# EAGLE schematic en_v5 (EAGLE 9.6.2)

## Sheet 1 of 6: Header and connector
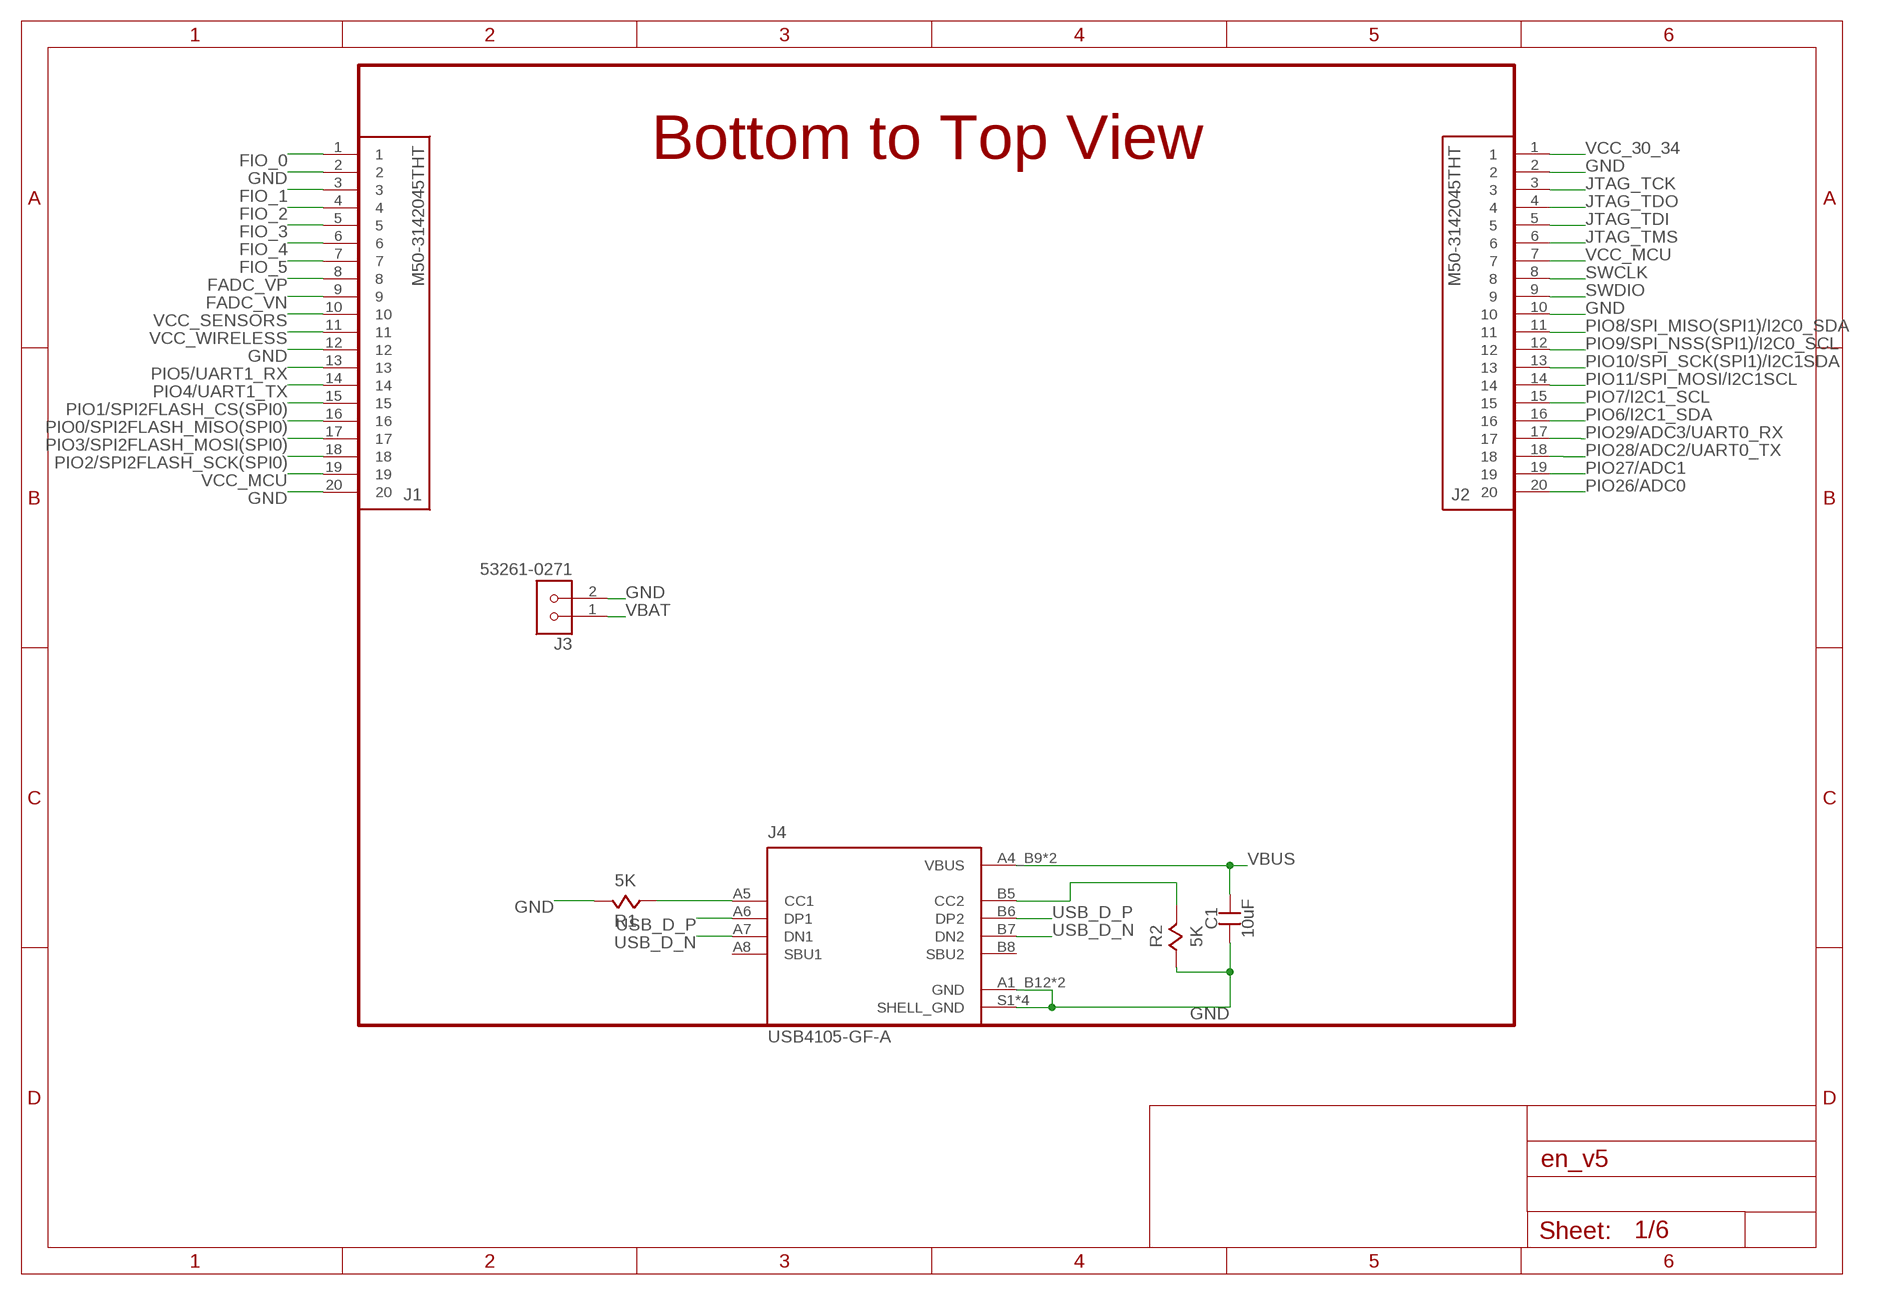
[diagram p0: schematic, sheet 1]

### Parts
C1  10uF  CAPACITOR0805  [0805]
J1  M50-3142045THT  [20X1_HEADER_THT_1.27MM]
J2  M50-3142045THT  [20X1_HEADER_THT_1.27MM]
J3  53261-0271  [MOLEX_53261-0271]
J4  USB4105-GF-A  [GCT_USB4105-GF-A]
R1  5K  RESISTORSMD_0402  [0402]
R2  5K  RESISTORSMD_0402  [0402]

### Nets
FADC_VN: J1.9 ; also sheet 5
FADC_VP: J1.8 ; also sheet 5
FIO_0: J1.1 ; also sheet 5
FIO_1: J1.3 ; also sheet 5
FIO_2: J1.4 ; also sheet 5
FIO_3: J1.5 ; also sheet 5
FIO_4: J1.6 ; also sheet 5
FIO_5: J1.7 ; also sheet 5
GND: C1.1 J1.2 J1.12 J1.20 J2.2 J2.10 J3.2 J4.A1_B12(GND) J4.B1_A12(GND) J4.S1(SHELL_GND) J4.S2(SHELL_GND) J4.S3(SHELL_GND) J4.S4(SHELL_GND) R1.2 R2.1 ; also sheet 2,3,4,5,6
JTAG_TCK: J2.3 ; also sheet 5
JTAG_TDI: J2.5 ; also sheet 5
JTAG_TDO: J2.4 ; also sheet 5
JTAG_TMS: J2.6 ; also sheet 5
N$19: J4.B5(CC2) R2.2
N$35: J4.A5(CC1) R1.1
PIO0/SPI2FLASH_MISO(SPI0): J1.16 ; also sheet 4,6
PIO1/SPI2FLASH_CS(SPI0): J1.15 ; also sheet 4,5,6
PIO2/SPI2FLASH_SCK(SPI0): J1.18 ; also sheet 4,5,6
PIO3/SPI2FLASH_MOSI(SPI0): J1.17 ; also sheet 4,6
PIO4/UART1_TX: J1.14 ; also sheet 4
PIO5/UART1_RX: J1.13 ; also sheet 4
PIO6/I2C1_SDA: J2.16 ; also sheet 3,4
PIO7/I2C1_SCL: J2.15 ; also sheet 3,4
PIO8/SPI_MISO(SPI1)/I2C0_SDA: J2.11 ; also sheet 4
PIO9/SPI_NSS(SPI1)/I2C0_SCL: J2.12 ; also sheet 4
PIO10/SPI_SCK(SPI1)/I2C1SDA: J2.13 ; also sheet 4
PIO11/SPI_MOSI/I2C1SCL: J2.14 ; also sheet 4
PIO26/ADC0: J2.20 ; also sheet 4
PIO27/ADC1: J2.19 ; also sheet 4
PIO28/ADC2/UART0_TX: J2.18 ; also sheet 3,4
PIO29/ADC3/UART0_RX: J2.17 ; also sheet 3,4
SWCLK: J2.8 ; also sheet 4
SWDIO: J2.9 ; also sheet 4
USB_D_N [diff pairs]: J4.A7(DN1) J4.B7(DN2) ; also sheet 4
USB_D_P [diff pairs]: J4.A6(DP1) J4.B6(DP2) ; also sheet 4
VBAT: J3.1 ; also sheet 2
VBUS: C1.2 J4.A4_B9(VBUS) J4.B4_A9(VBUS) ; also sheet 2
VCC_30_34: J2.1 ; also sheet 3,5,6
VCC_MCU: J1.19 J2.7 ; also sheet 3,4
VCC_SENSORS: J1.10 ; also sheet 3,6
VCC_WIRELESS: J1.11 ; also sheet 3
Unconnected: J4.A8(SBU1) J4.B8(SBU2)

### Notes on the sheet
- Bottom to Top View

## Sheet 2 of 6: Power Management
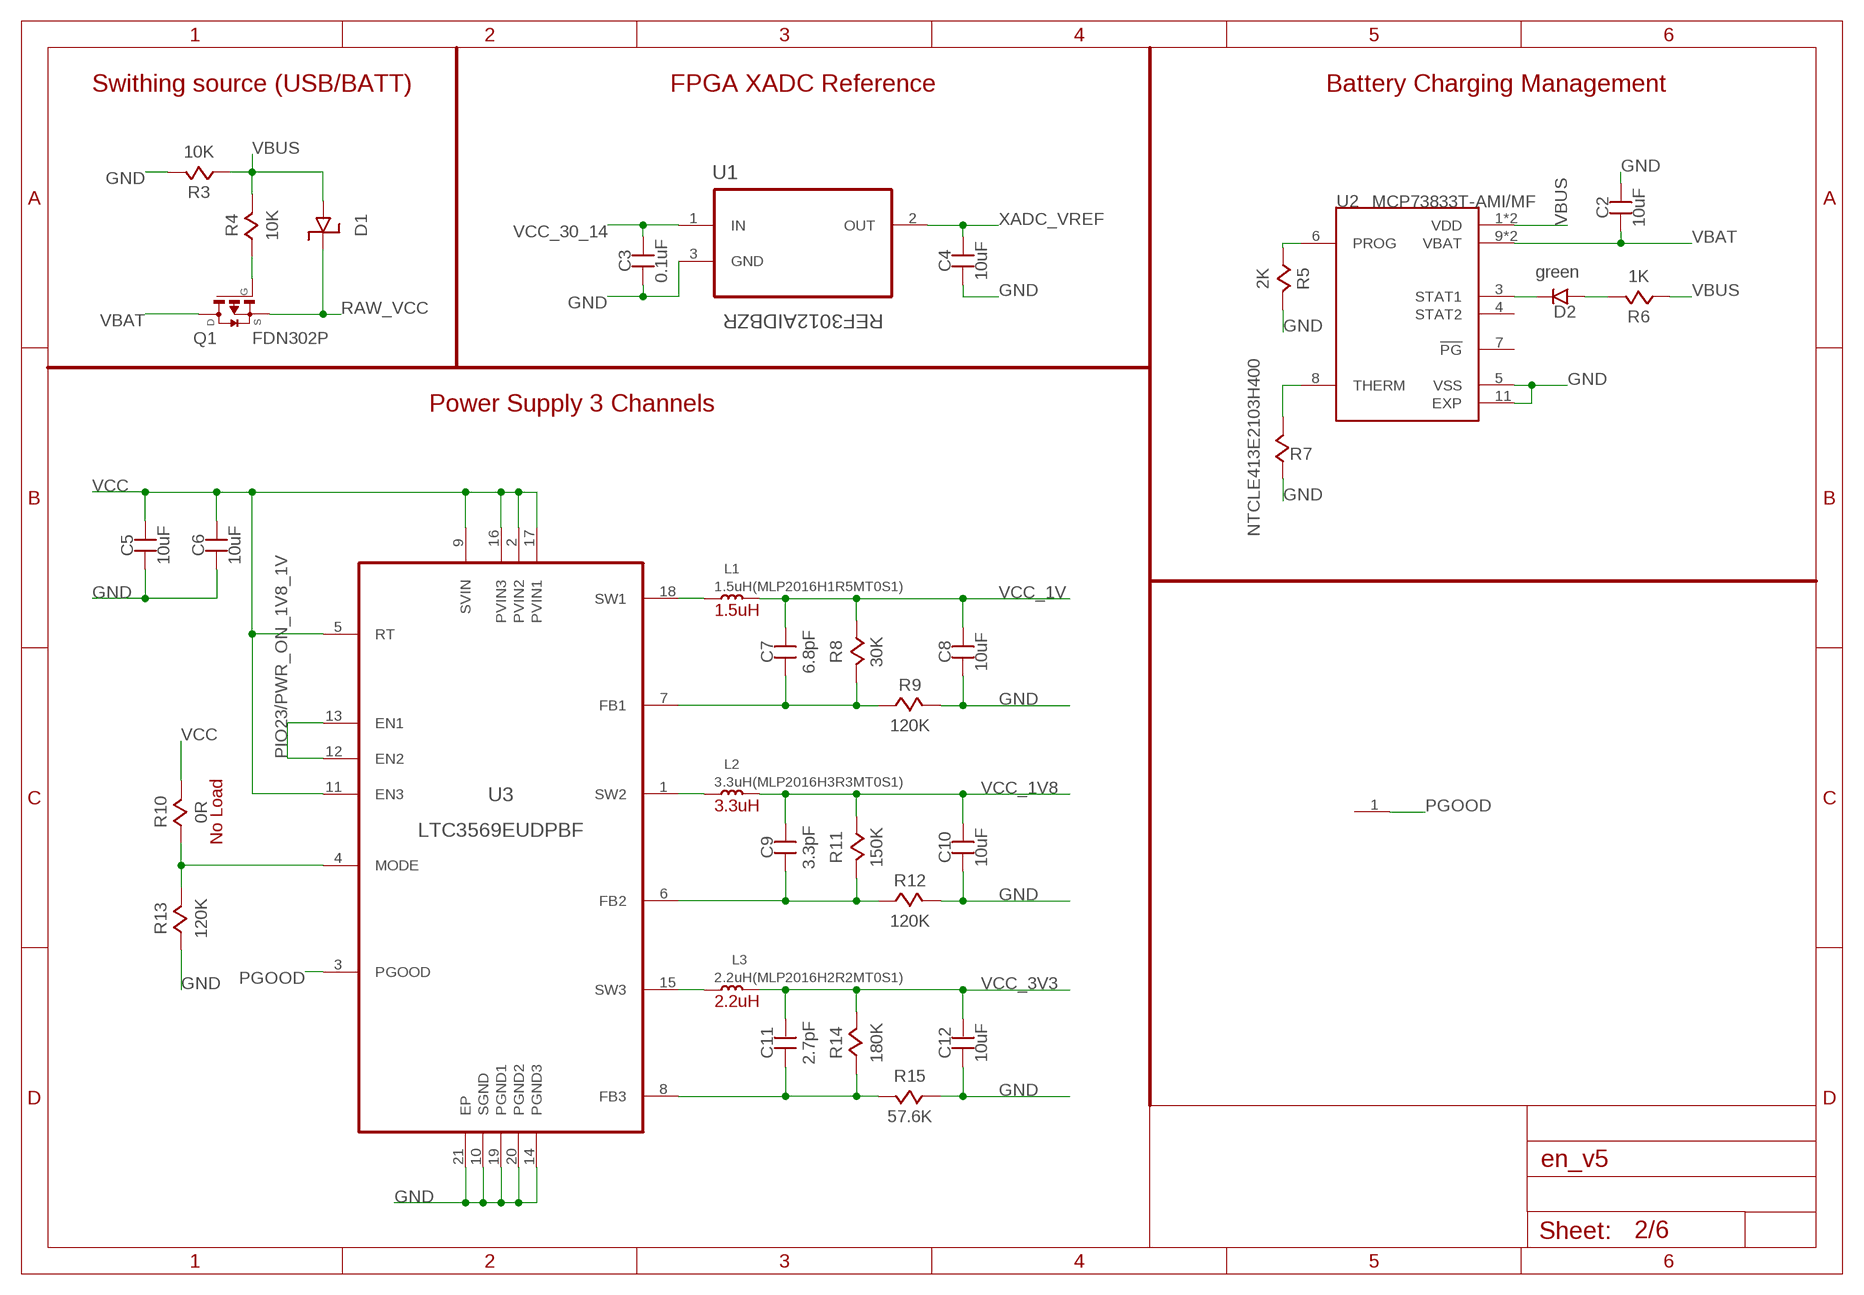
[diagram p1: schematic, sheet 2]

### Parts
C2  10uF  CAPACITOR0805  [0805]
C3  0.1uF  CAPACITOR0402  [0402]
C4  10uF  CAPACITOR0603  [CAPC1608-0603]
C5  10uF  CAPACITOR0603  [CAPC1608-0603]
C6  10uF  CAPACITOR0603  [CAPC1608-0603]
C7  6.8pF  CAPACITOR0402  [0402]
C8  10uF  CAPACITOR0603  [CAPC1608-0603]
C9  3.3pF  CAPACITOR0402  [0402]
C10  10uF  CAPACITOR0603  [CAPC1608-0603]
C11  2.7pF  CAPACITOR0402  [0402]
C12  10uF  CAPACITOR0603  [CAPC1608-0603]
D1  DIODEB5817W  SCHOTTKY_DIODEB5817W  [SOD-123]
D2  green  LED0402  [0402]
L1  1.5uH(MLP2016H1R5MT0S1)  INDUCTORDFE201612E-R33M=P2  [INDC2016X120N]
L2  3.3uH(MLP2016H3R3MT0S1)  INDUCTORDFE201612E-R33M=P2  [INDC2016X120N]
L3  2.2uH(MLP2016H2R2MT0S1)  INDUCTORDFE201612E-R33M=P2  [INDC2016X120N]
Q1  FDN302P  [SSOT-3]
R3  10K  RESISTORSMD_0402  [0402]
R4  10K  RESISTORSMD_0402  [0402]
R5  2K  RESISTORSMD_0402  [0402]
R6  1K  RESISTORSMD_0402  [0402]
R7  NTCLE413E2103H400  RESISTORTHT_THERMAL  [THT_2]
R8  30K  RESISTORSMD_0402  [0402]
R9  120K  RESISTORSMD_0402  [0402]
R10  0R  RESISTORSMD_0402  [0402]
R11  150K  RESISTORSMD_0402  [0402]
R12  120K  RESISTORSMD_0402  [0402]
R13  120K  RESISTORSMD_0402  [0402]
R14  180K  RESISTORSMD_0402  [0402]
R15  57.6K  RESISTORSMD_0402  [0402]
TP2  TEST_POINTSMD  [SMD_PAD]
U1  REF3012AIDBZR  [SOT-23(3PIN)]
U2  MCP73833T-AMI/MF  [DFN-10(3X3X0.9)]
U3  LTC3569EUDPBF  [QFN40P300X300X80-21N]

### Nets
GND: C2.2 C3.1 C4.1 C5.2 C6.2 C8.1 C10.2 C12.2 R3.2 R5.2 R7.P$1 R9.2 R12.2 R13.1 R15.2 U1.3(GND) U2.5(VSS) U2.11(EXP) U3.10(SGND) U3.14(PGND3) U3.19(PGND1) U3.20(PGND2) U3.21(EP) ; also sheet 1,3,4,5,6
N$1: R7.P$2 U2.8(THERM)
N$2: R5.1 U2.6(PROG)
N$3: Q1.1(G) R4.1
N$4: L2.1 U3.1(SW2)
N$5: L1.1 U3.18(SW1)
N$6: D2.2 U2.3(STAT1)
N$7: D2.1 R6.2
N$8: C7.2 R8.2 R9.1 U3.7(FB1)
N$9: L3.2 U3.15(SW3)
N$11: C11.2 R14.2 R15.1 U3.8(FB3)
N$12: C9.2 R11.2 R12.1 U3.6(FB2)
N$23: R10.1 R13.2 U3.4(MODE)
PGOOD: TP2.1(>NAME) U3.3(PGOOD)
PIO23/PWR_ON_1V8_1V: U3.12(EN2) U3.13(EN1) ; also sheet 4
RAW_VCC: D1.1(C) Q1.2(S) ; also sheet 3
VBAT: C2.1 Q1.3(D) U2.9(VBAT) U2.10(VBAT) ; also sheet 1
VBUS: D1.2(A) R3.1 R4.2 R6.1 U2.1(VDD) U2.2(VDD) ; also sheet 1
VCC: C5.1 C6.1 R10.2 U3.2(PVIN2) U3.5(RT) U3.9(SVIN) U3.11(EN3) U3.16(PVIN3) U3.17(PVIN1) ; also sheet 3
VCC_1V: C7.1 C8.2 L1.2 R8.1 ; also sheet 3
VCC_1V8: C9.1 C10.1 L2.2 R11.1 ; also sheet 3
VCC_3V3: C11.1 C12.1 L3.1 R14.1 ; also sheet 3
VCC_30_14: C3.2 U1.1(IN) ; also sheet 3,5,6
XADC_VREF: C4.2 U1.2(OUT) ; also sheet 5
Unconnected: U2.4(STAT2) U2.7(!PG)

### Notes on the sheet
- Swithing source (USB/BATT) | FPGA XADC Reference | Battery Charging Management
- Power Supply 3 Channels
- 1.5uH
- No Load | 3.3uH
- 2.2uH

## Sheet 3 of 6: Power Monitor
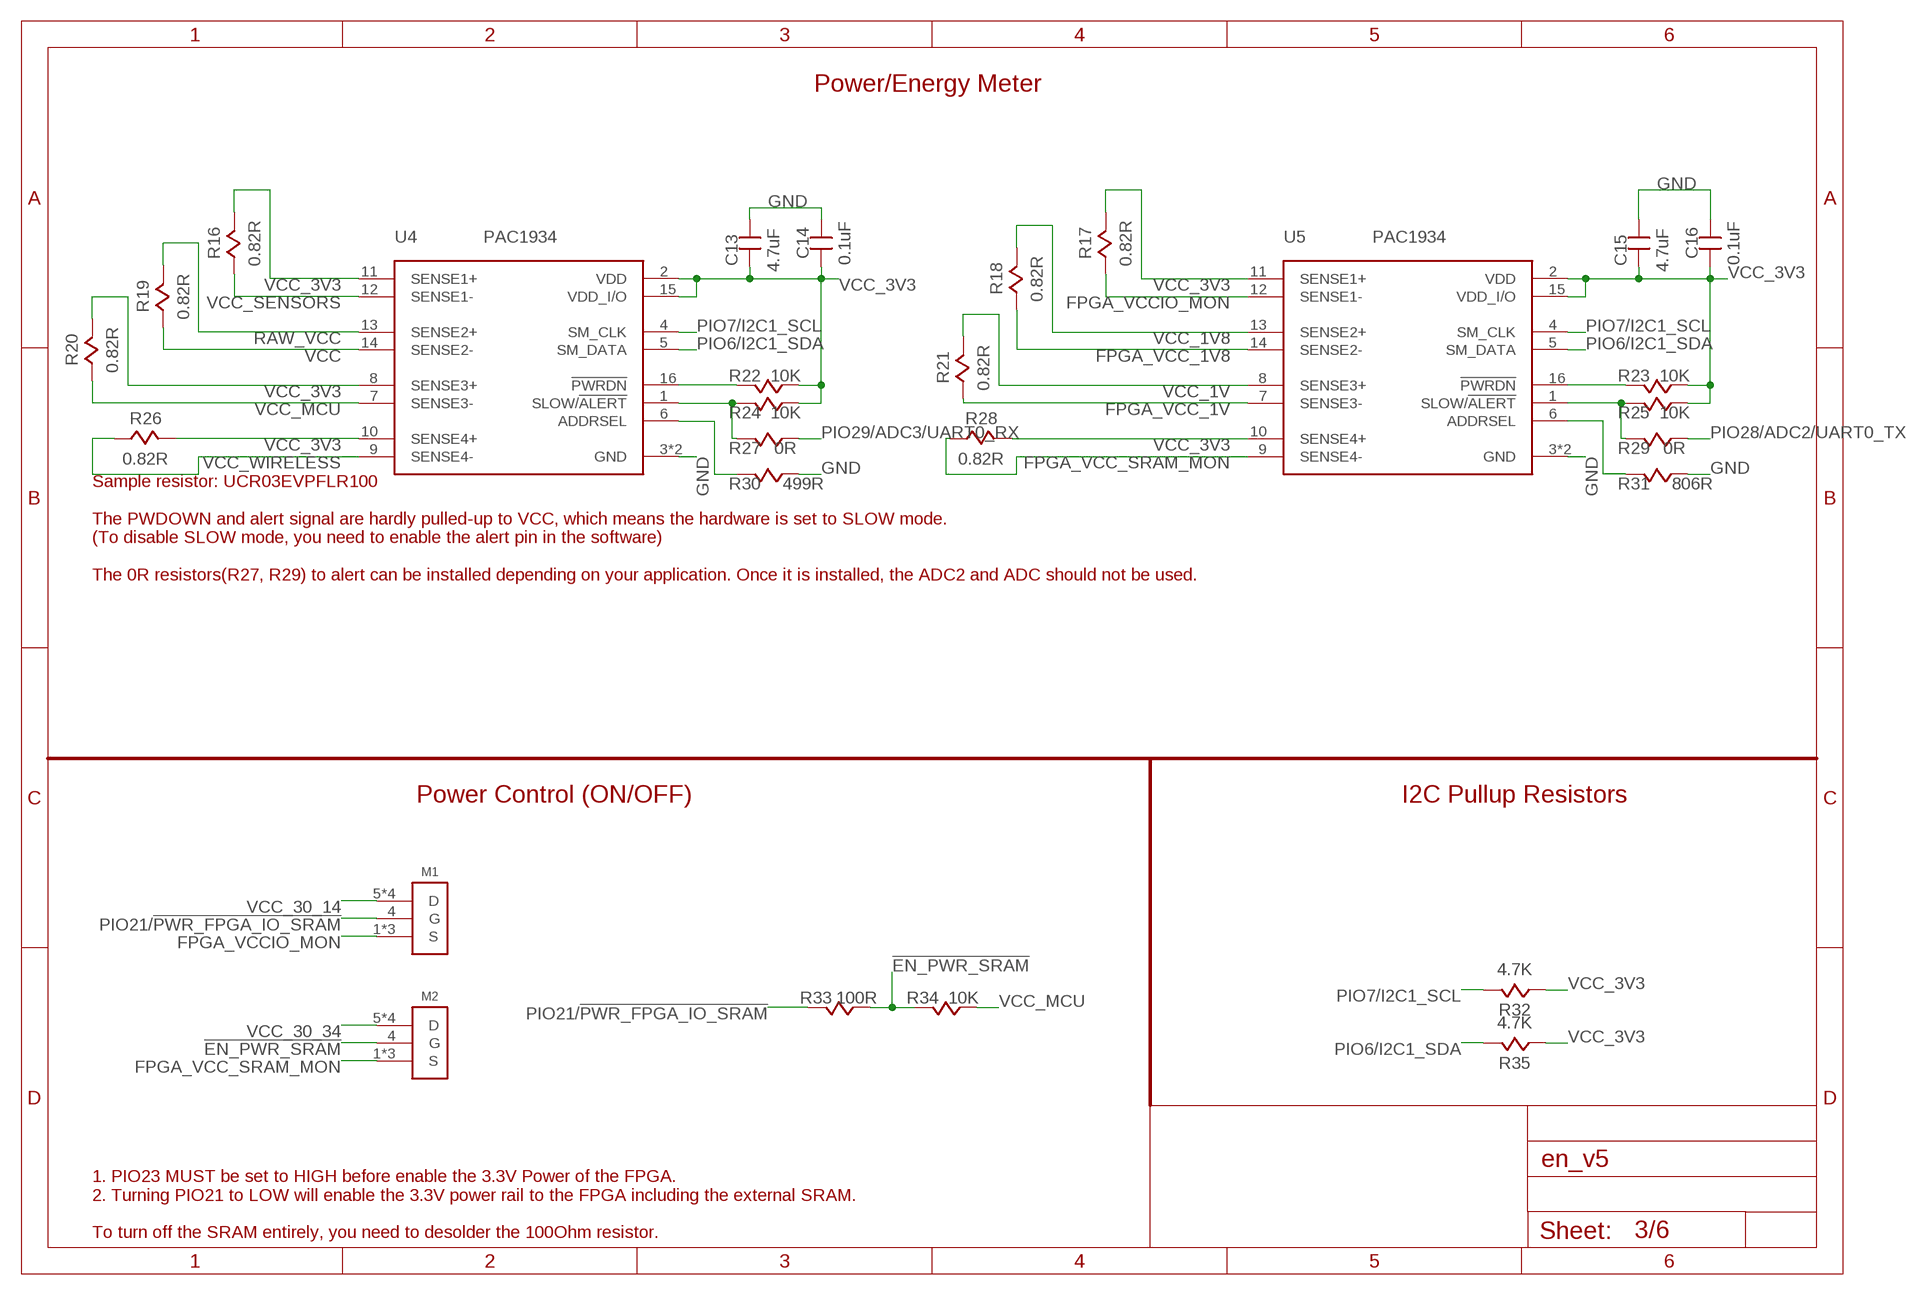
[diagram p2: schematic, sheet 3]

### Parts
C13  4.7uF  CAPACITOR0603  [CAPC1608-0603]
C14  0.1uF  CAPACITOR0402  [0402]
C15  4.7uF  CAPACITOR0603  [CAPC1608-0603]
C16  0.1uF  CAPACITOR0402  [0402]
M1  SISS23DN  [POWERPAK1212-8]
M2  SISS23DN  [POWERPAK1212-8]
R16  0.82R  RESISTOR0603  [0603]
R17  0.82R  RESISTOR0603  [0603]
R18  0.82R  RESISTOR0603  [0603]
R19  0.82R  RESISTOR0603  [0603]
R20  0.82R  RESISTOR0603  [0603]
R21  0.82R  RESISTOR0603  [0603]
R22  10K  RESISTORSMD_0402  [0402]
R23  10K  RESISTORSMD_0402  [0402]
R24  10K  RESISTORSMD_0402  [0402]
R25  10K  RESISTORSMD_0402  [0402]
R26  0.82R  RESISTOR0603  [0603]
R27  0R  RESISTORSMD_0402  [0402]
R28  0.82R  RESISTOR0603  [0603]
R29  0R  RESISTORSMD_0402  [0402]
R30  499R  RESISTORSMD_0402  [0402]
R31  806R  RESISTORSMD_0402  [0402]
R32  4.7K  RESISTORSMD_0402  [0402]
R33  100R  RESISTORSMD_0402  [0402]
R34  10K  RESISTORSMD_0402  [0402]
R35  4.7K  RESISTORSMD_0402  [0402]
U4  PAC1934  [UQFN-16(4×4×0.5MM)]
U5  PAC1934  [UQFN-16(4×4×0.5MM)]

### Nets
!EN_PWR_SRAM: M2.4(G) R33.1 R34.2
FPGA_VCC_1V: R21.1 U5.7(SENSE3-) ; also sheet 5,6
FPGA_VCC_1V8: R18.1 U5.14(SENSE2-) ; also sheet 5,6
FPGA_VCC_SRAM_MON: M2.1(S) M2.2(S) M2.3(S) R28.1 U5.9(SENSE4-)
FPGA_VCCIO_MON: M1.1(S) M1.2(S) M1.3(S) R17.1 U5.12(SENSE1-)
GND: C13.2 C14.2 C15.2 C16.2 R30.1 R31.1 U4.3(GND) U4.17(GND) U5.3(GND) U5.17(GND) ; also sheet 1,2,4,5,6
N$13: R24.2 R27.2 U4.1(SLOW/!ALERT)
N$21: R25.2 R29.2 U5.1(SLOW/!ALERT)
N$32: R22.2 U4.16(!PWRDN)
N$34: R30.2 U4.6(ADDRSEL)
N$48: R23.2 U5.16(!PWRDN)
N$50: R31.2 U5.6(ADDRSEL)
PIO6/I2C1_SDA: R35.2 U4.5(SM_DATA) U5.5(SM_DATA) ; also sheet 1,4
PIO7/I2C1_SCL: R32.2 U4.4(SM_CLK) U5.4(SM_CLK) ; also sheet 1,4
PIO21/!PWR_FPGA_IO_SRAM: M1.4(G) R33.2 ; also sheet 4
PIO28/ADC2/UART0_TX: R29.1 ; also sheet 1,4
PIO29/ADC3/UART0_RX: R27.1 ; also sheet 1,4
RAW_VCC: R19.2 U4.13(SENSE2+) ; also sheet 2
VCC: R19.1 U4.14(SENSE2-) ; also sheet 2
VCC_1V: R21.2 U5.8(SENSE3+) ; also sheet 2
VCC_1V8: R18.2 U5.13(SENSE2+) ; also sheet 2
VCC_3V3: C13.1 C14.1 C15.1 C16.1 R16.2 R17.2 R20.2 R22.1 R23.1 R24.1 R25.1 R26.2 R28.2 R32.1 R35.1 U4.2(VDD) U4.8(SENSE3+) U4.10(SENSE4+) U4.11(SENSE1+) U4.15(VDD_I/O) U5.2(VDD) U5.10(SENSE4+) U5.11(SENSE1+) U5.15(VDD_I/O) ; also sheet 2
VCC_30_14: M1.5(D) M1.6(D) M1.7(D) M1.8(D) ; also sheet 2,5,6
VCC_30_34: M2.5(D) M2.6(D) M2.7(D) M2.8(D) ; also sheet 1,5,6
VCC_MCU: R20.1 R34.1 U4.7(SENSE3-) ; also sheet 1,4
VCC_SENSORS: R16.1 U4.12(SENSE1-) ; also sheet 1,6
VCC_WIRELESS: R26.1 U4.9(SENSE4-) ; also sheet 1

### Notes on the sheet
- Power/Energy Meter
- Sample resistor: UCR03EVPFLR100
  
  The PWDOWN and alert signal are hardly pulled-up to VCC, which means the hardware is set to SLOW mode.
  (To disable SLOW mode, you need to enable the alert pin in the software)
  
  The 0R resistors(R27, R29) to alert can be installed depending on your application. Once it is installed, the ADC2 and ADC should not be used.
- Power Control (ON/OFF) | I2C Pullup Resistors
- 1. PIO23 MUST be set to HIGH before enable the 3.3V Power of the FPGA.
  2. Turning PIO21 to LOW will enable the 3.3V power rail to the FPGA including the external SRAM.
  
  To turn off the SRAM entirely, you need to desolder the 100Ohm resistor.

## Sheet 4 of 6: MCU
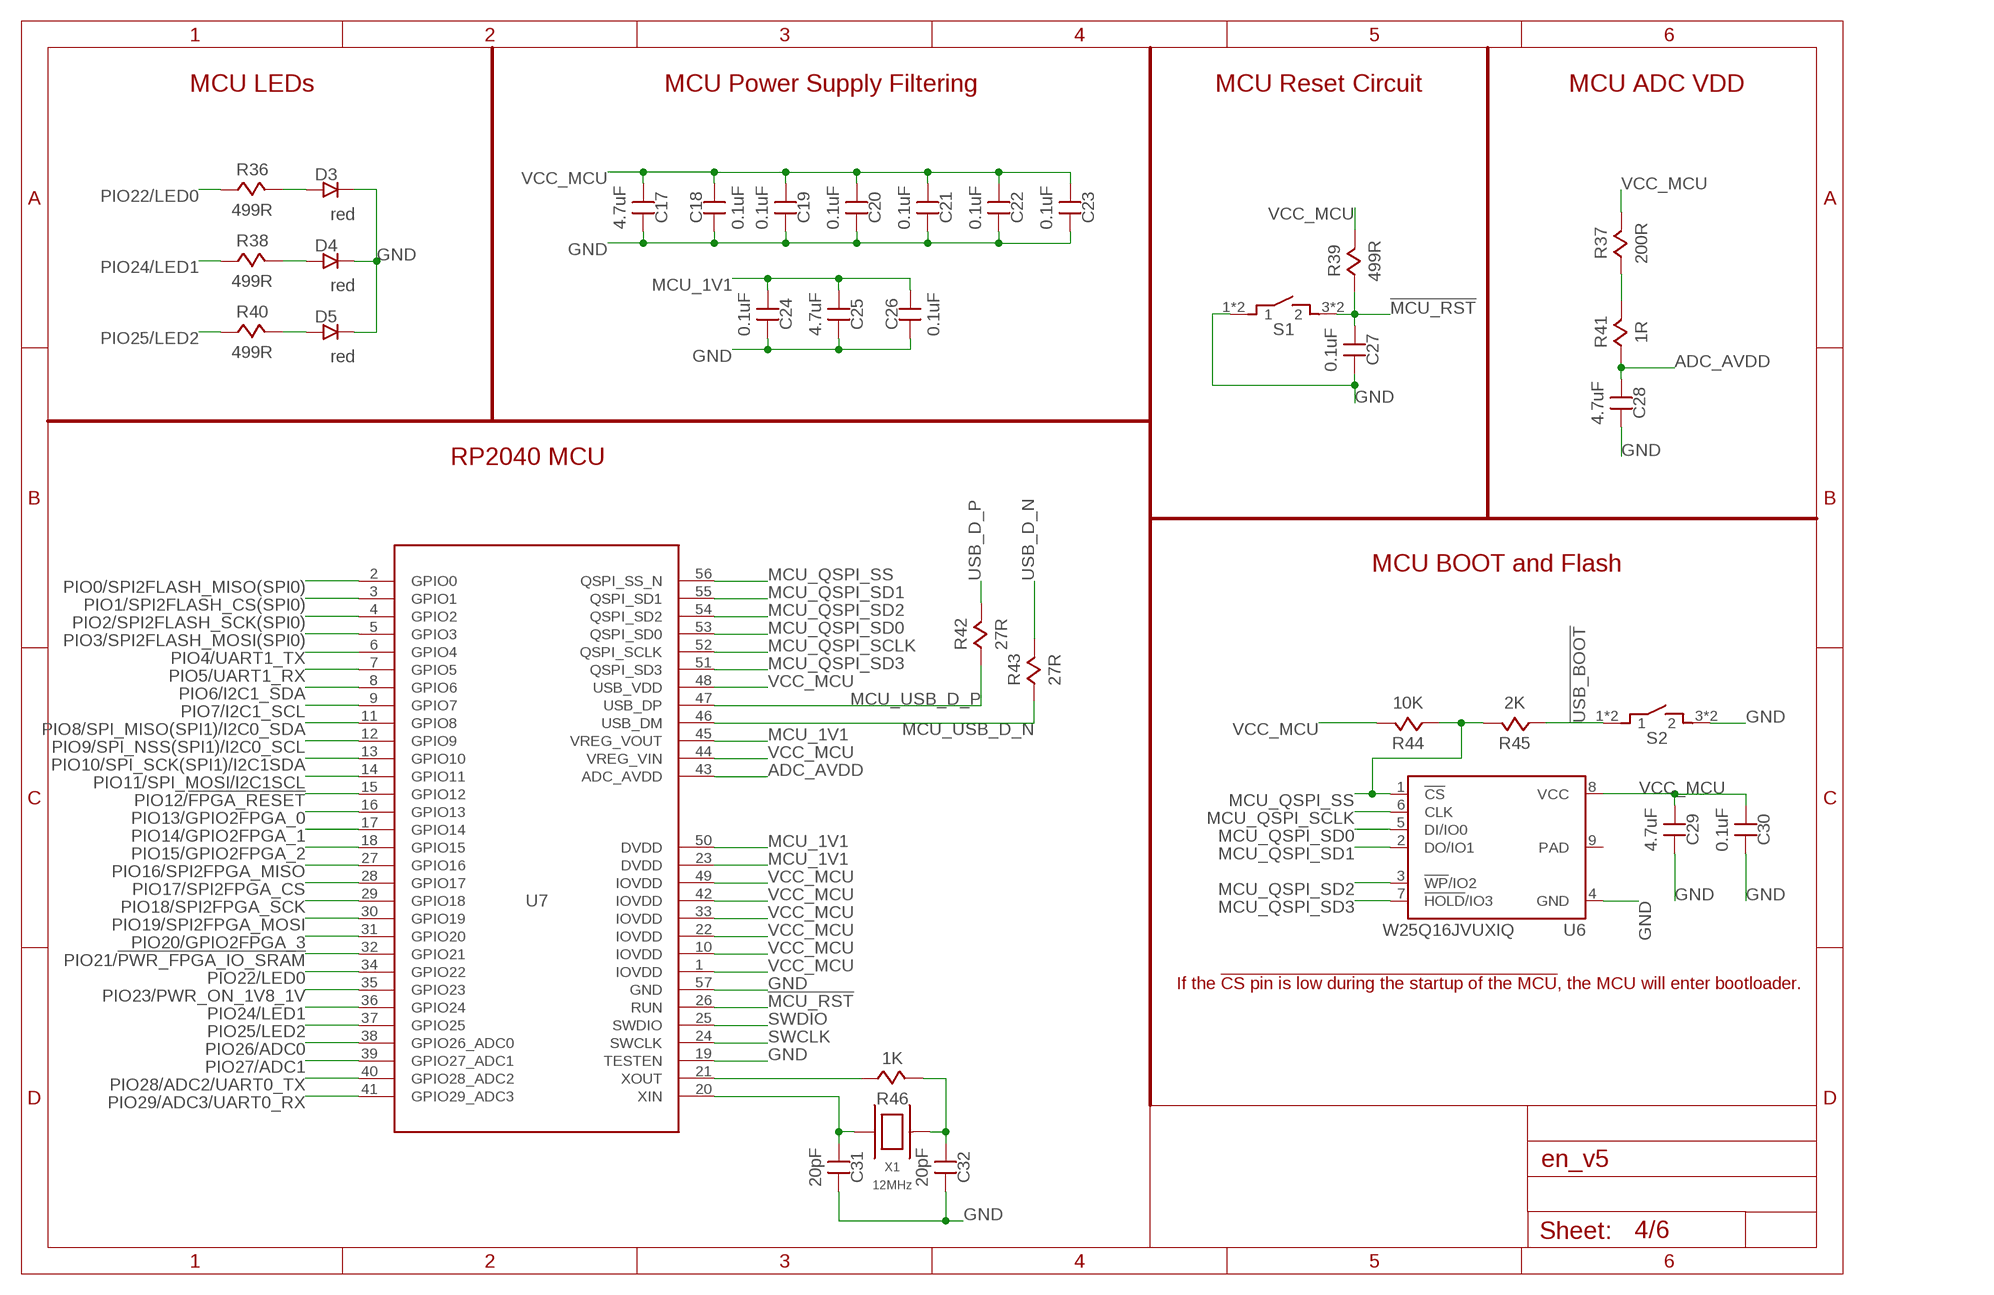
[diagram p3: schematic, sheet 4]

### Parts
C17  4.7uF  CAPACITOR0603  [CAPC1608-0603]
C18  0.1uF  CAPACITOR0402  [0402]
C19  0.1uF  CAPACITOR0402  [0402]
C20  0.1uF  CAPACITOR0402  [0402]
C21  0.1uF  CAPACITOR0402  [0402]
C22  0.1uF  CAPACITOR0402  [0402]
C23  0.1uF  CAPACITOR0402  [0402]
C24  0.1uF  CAPACITOR0402  [0402]
C25  4.7uF  CAPACITOR0603  [CAPC1608-0603]
C26  0.1uF  CAPACITOR0402  [0402]
C27  0.1uF  CAPACITOR0402  [0402]
C28  4.7uF  CAPACITOR0603  [CAPC1608-0603]
C29  4.7uF  CAPACITOR0603  [CAPC1608-0603]
C30  0.1uF  CAPACITOR0402  [0402]
C31  20pF  CAPACITOR0402  [0402]
C32  20pF  CAPACITOR0402  [0402]
D3  red  LED0402  [0402]
D4  red  LED0402  [0402]
D5  red  LED0402  [0402]
R36  499R  RESISTORSMD_0402  [0402]
R37  200R  RESISTORSMD_0402  [0402]
R38  499R  RESISTORSMD_0402  [0402]
R39  499R  RESISTORSMD_0402  [0402]
R40  499R  RESISTORSMD_0402  [0402]
R41  1R  RESISTORSMD_0402  [0402]
R42  27R  RESISTORSMD_0402  [0402]
R43  27R  RESISTORSMD_0402  [0402]
R44  10K  RESISTORSMD_0402  [0402]
R45  2K  RESISTORSMD_0402  [0402]
R46  1K  RESISTORSMD_0402  [0402]
S1  TACTILE-SWITCH  [TACTILE-SWITCH]
S2  TACTILE-SWITCH  [TACTILE-SWITCH]
U6  W25Q16JVUXIQ  [USON8-2X3MM]
U7  RP2040  [QFN40P700X700X100-57T310N]
X1  12MHz  QUARTZ  [3.2X2.5_OSC]

### Nets
!MCU_RST: C27.1 R39.1 S1.3 S1.4 U7.26(RUN)
!USB_BOOT: R45.1 S2.1 S2.2
ADC_AVDD: C28.1 R41.1 U7.43(ADC_AVDD)
ADC_VREF: R37.1 R41.2
GND: C17.2 C18.1 C19.2 C20.2 C21.2 C22.2 C23.2 C24.2 C25.2 C26.1 C27.2 C28.2 C29.2 C30.2 C31.2 C32.2 D3.2 D4.2 D5.2 S1.1 S1.2 S2.3 S2.4 U6.4(GND) U7.19(TESTEN) U7.57(GND) ; also sheet 1,2,3,5,6
MCU_1V1: C24.1 C25.1 C26.2 U7.23(DVDD) U7.45(VREG_VOUT) U7.50(DVDD)
MCU_QSPI_SCLK: U6.6(CLK) U7.52(QSPI_SCLK)
MCU_QSPI_SD0: U6.5(DI/IO0) U7.53(QSPI_SD0)
MCU_QSPI_SD1: U6.2(DO/IO1) U7.55(QSPI_SD1)
MCU_QSPI_SD2: U6.3(!WP!/IO2) U7.54(QSPI_SD2)
MCU_QSPI_SD3: U6.7(!HOLD!/IO3) U7.51(QSPI_SD3)
MCU_QSPI_SS: R44.1 R45.2 U6.1(!CS) U7.56(QSPI_SS_N)
MCU_USB_D_N: R43.1 U7.46(USB_DM)
MCU_USB_D_P: R42.1 U7.47(USB_DP)
N$15: R46.1 U7.21(XOUT)
N$17: C32.1 R46.2 X1.3
N$20: C31.1 U7.20(XIN) X1.1
N$70: D3.1 R36.2
N$71: D4.1 R38.2
N$72: D5.1 R40.2
PIO0/SPI2FLASH_MISO(SPI0): U7.2(GPIO0) ; also sheet 1,6
PIO1/SPI2FLASH_CS(SPI0): U7.3(GPIO1) ; also sheet 1,5,6
PIO2/SPI2FLASH_SCK(SPI0): U7.4(GPIO2) ; also sheet 1,5,6
PIO3/SPI2FLASH_MOSI(SPI0): U7.5(GPIO3) ; also sheet 1,6
PIO4/UART1_TX: U7.6(GPIO4) ; also sheet 1
PIO5/UART1_RX: U7.7(GPIO5) ; also sheet 1
PIO6/I2C1_SDA: U7.8(GPIO6) ; also sheet 1,3
PIO7/I2C1_SCL: U7.9(GPIO7) ; also sheet 1,3
PIO8/SPI_MISO(SPI1)/I2C0_SDA: U7.11(GPIO8) ; also sheet 1
PIO9/SPI_NSS(SPI1)/I2C0_SCL: U7.12(GPIO9) ; also sheet 1
PIO10/SPI_SCK(SPI1)/I2C1SDA: U7.13(GPIO10) ; also sheet 1
PIO11/SPI_MOSI/I2C1SCL: U7.14(GPIO11) ; also sheet 1
PIO12/!FPGA_RESET: U7.15(GPIO12) ; also sheet 5,6
PIO13/GPIO2FPGA_0: U7.16(GPIO13) ; also sheet 5
PIO14/GPIO2FPGA_1: U7.17(GPIO14) ; also sheet 5
PIO15/GPIO2FPGA_2: U7.18(GPIO15) ; also sheet 5
PIO16/SPI2FPGA_MISO: U7.27(GPIO16) ; also sheet 5
PIO17/SPI2FPGA_CS: U7.28(GPIO17) ; also sheet 5
PIO18/SPI2FPGA_SCK: U7.29(GPIO18) ; also sheet 5
PIO19/SPI2FPGA_MOSI: U7.30(GPIO19) ; also sheet 5
PIO20/GPIO2FPGA_3: U7.31(GPIO20) ; also sheet 5
PIO21/!PWR_FPGA_IO_SRAM: U7.32(GPIO21) ; also sheet 3
PIO22/LED0: R36.1 U7.34(GPIO22)
PIO23/PWR_ON_1V8_1V: U7.35(GPIO23) ; also sheet 2
PIO24/LED1: R38.1 U7.36(GPIO24)
PIO25/LED2: R40.1 U7.37(GPIO25)
PIO26/ADC0: U7.38(GPIO26_ADC0) ; also sheet 1
PIO27/ADC1: U7.39(GPIO27_ADC1) ; also sheet 1
PIO28/ADC2/UART0_TX: U7.40(GPIO28_ADC2) ; also sheet 1,3
PIO29/ADC3/UART0_RX: U7.41(GPIO29_ADC3) ; also sheet 1,3
SWCLK: U7.24(SWCLK) ; also sheet 1
SWDIO: U7.25(SWDIO) ; also sheet 1
USB_D_N [diff pairs]: R43.2 ; also sheet 1
USB_D_P [diff pairs]: R42.2 ; also sheet 1
VCC_MCU: C17.1 C18.2 C19.1 C20.1 C21.1 C22.1 C23.1 C29.1 C30.1 R37.2 R39.2 R44.2 U6.8(VCC) U7.1(IOVDD) U7.10(IOVDD) U7.22(IOVDD) U7.33(IOVDD) U7.42(IOVDD) U7.44(VREG_VIN) U7.48(USB_VDD) U7.49(IOVDD) ; also sheet 1,3
Unconnected: U6.9(PAD)

### Notes on the sheet
- MCU LEDs | MCU Power Supply Filtering | MCU Reset Circuit | MCU ADC VDD
- RP2040 MCU
- MCU BOOT and Flash
- If the !CS pin is low during the startup of the MCU, the MCU will enter bootloader.

## Sheet 5 of 6: FPGA Main
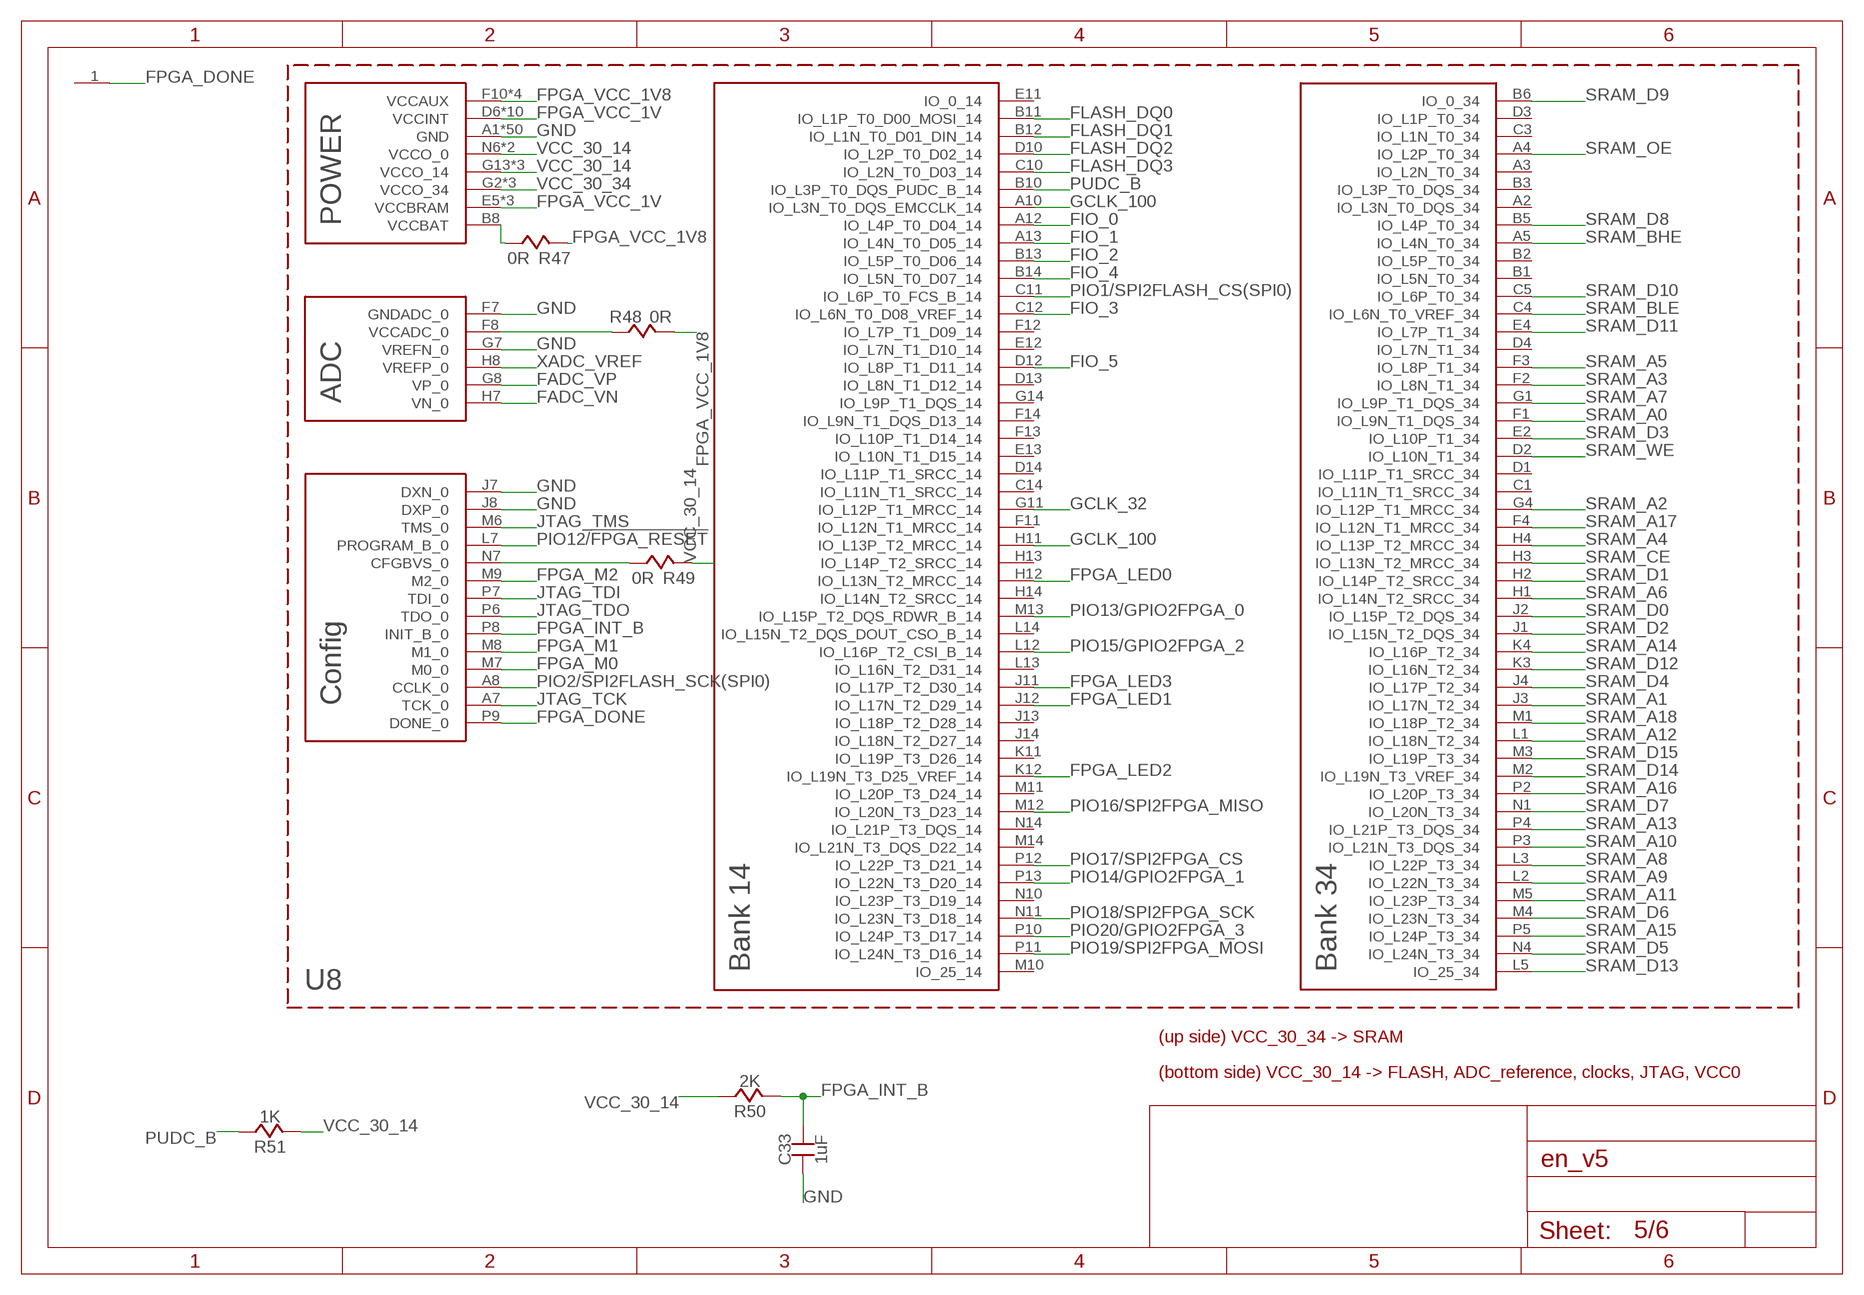
[diagram p4: schematic, sheet 5]

### Parts
C33  1uF  CAPACITOR0402  [0402]
R47  0R  RESISTORSMD_0402  [0402]
R48  0R  RESISTORSMD_0402  [0402]
R49  0R  RESISTORSMD_0402  [0402]
R50  2K  RESISTORSMD_0402  [0402]
R51  1K  RESISTORSMD_0402  [0402]
TP1  TEST_POINTSMD  [SMD_PAD]
U8  SPARTAN7-LX15  [FTGB196]

### Nets
FADC_VN: U8.H7(VN_0) ; also sheet 1
FADC_VP: U8.G8(VP_0) ; also sheet 1
FIO_0: U8.A12(IO_L4P_T0_D04_14) ; also sheet 1
FIO_1: U8.A13(IO_L4N_T0_D05_14) ; also sheet 1
FIO_2: U8.B13(IO_L5P_T0_D06_14) ; also sheet 1
FIO_3: U8.C12(IO_L6N_T0_D08_VREF_14) ; also sheet 1
FIO_4: U8.B14(IO_L5N_T0_D07_14) ; also sheet 1
FIO_5: U8.D12(IO_L8P_T1_D11_14) ; also sheet 1
FLASH_DQ0: U8.B11(IO_L1P_T0_D00_MOSI_14) ; also sheet 6
FLASH_DQ1: U8.B12(IO_L1N_T0_D01_DIN_14) ; also sheet 6
FLASH_DQ2: U8.D10(IO_L2P_T0_D02_14) ; also sheet 6
FLASH_DQ3: U8.C10(IO_L2N_T0_D03_14) ; also sheet 6
FPGA_DONE: TP1.1(>NAME) U8.P9(DONE_0)
FPGA_INT_B: C33.2 R50.2 U8.P8(INIT_B_0)
FPGA_LED0: U8.H12(IO_L13N_T2_MRCC_14) ; also sheet 6
FPGA_LED1: U8.J12(IO_L17N_T2_D29_14) ; also sheet 6
FPGA_LED2: U8.K12(IO_L19N_T3_D25_VREF_14) ; also sheet 6
FPGA_LED3: U8.J11(IO_L17P_T2_D30_14) ; also sheet 6
FPGA_M0: U8.M7(M0_0) ; also sheet 6
FPGA_M1: U8.M8(M1_0) ; also sheet 6
FPGA_M2: U8.M9(M2_0) ; also sheet 6
FPGA_VCC_1V: U8.D6(VCCINT) U8.D8(VCCINT) U8.E5(VCCBRAM) U8.E7(VCCINT) U8.E9(VCCINT) U8.F6(VCCINT) U8.G5(VCCBRAM) U8.G9(VCCINT) U8.H6(VCCINT) U8.J5(VCCBRAM) U8.J9(VCCINT) U8.K6(VCCINT) U8.K8(VCCINT) ; also sheet 3,6
FPGA_VCC_1V8: R47.2 R48.2 U8.F10(VCCAUX) U8.H10(VCCAUX) U8.K10(VCCAUX) U8.L9(VCCAUX) ; also sheet 3,6
GCLK_32: U8.G11(IO_L12P_T1_MRCC_14) ; also sheet 6
GCLK_100: U8.A10(IO_L3N_T0_DQS_EMCCLK_14) U8.H11(IO_L13P_T2_MRCC_14) ; also sheet 6
GND: C33.1 U8.A1(GND) U8.A6(GND) U8.A9(GND) U8.A11(GND) U8.A14(GND) U8.B4(GND) U8.B7(GND) U8.B9(GND) U8.C2(GND) U8.C6(GND) U8.C7(GND) U8.C8(GND) U8.C9(GND) U8.C13(GND) U8.D5(GND) U8.D7(GND) U8.D9(GND) U8.D11(GND) U8.E1(GND) U8.E3(GND) U8.E6(GND) U8.E8(GND) U8.E10(GND) U8.E14(GND) U8.F5(GND) U8.F7(GNDADC_0) U8.F9(GND) U8.G3(GND) U8.G6(GND) U8.G7(VREFN_0) U8.G10(GND) U8.G12(GND) U8.H5(GND) U8.H9(GND) U8.J6(GND) U8.J7(DXN_0) U8.J8(DXP_0) U8.J10(GND) U8.K1(GND) U8.K5(GND) U8.K7(GND) U8.K9(GND) U8.K14(GND) U8.L4(GND) U8.L6(GND) U8.L8(GND) U8.L10(GND) U8.L11(GND) U8.N3(GND) U8.N5(GND) U8.N9(GND) U8.N12(GND) U8.P1(GND) U8.P14(GND) ; also sheet 1,2,3,4,6
JTAG_TCK: U8.A7(TCK_0) ; also sheet 1
JTAG_TDI: U8.P7(TDI_0) ; also sheet 1
JTAG_TDO: U8.P6(TDO_0) ; also sheet 1
JTAG_TMS: U8.M6(TMS_0) ; also sheet 1
N$10: R47.1 U8.B8(VCCBAT)
N$14: R49.1 U8.N7(CFGBVS_0)
N$16: R48.1 U8.F8(VCCADC_0)
PIO1/SPI2FLASH_CS(SPI0): U8.C11(IO_L6P_T0_FCS_B_14) ; also sheet 1,4,6
PIO2/SPI2FLASH_SCK(SPI0): U8.A8(CCLK_0) ; also sheet 1,4,6
PIO12/!FPGA_RESET: U8.L7(PROGRAM_B_0) ; also sheet 4,6
PIO13/GPIO2FPGA_0: U8.M13(IO_L15P_T2_DQS_RDWR_B_14) ; also sheet 4
PIO14/GPIO2FPGA_1: U8.P13(IO_L22N_T3_D20_14) ; also sheet 4
PIO15/GPIO2FPGA_2: U8.L12(IO_L16P_T2_CSI_B_14) ; also sheet 4
PIO16/SPI2FPGA_MISO: U8.M12(IO_L20N_T3_D23_14) ; also sheet 4
PIO17/SPI2FPGA_CS: U8.P12(IO_L22P_T3_D21_14) ; also sheet 4
PIO18/SPI2FPGA_SCK: U8.N11(IO_L23N_T3_D18_14) ; also sheet 4
PIO19/SPI2FPGA_MOSI: U8.P11(IO_L24N_T3_D16_14) ; also sheet 4
PIO20/GPIO2FPGA_3: U8.P10(IO_L24P_T3_D17_14) ; also sheet 4
PUDC_B: R51.1 U8.B10(IO_L3P_T0_DQS_PUDC_B_14)
SRAM_A0: U8.F1(IO_L9N_T1_DQS_34) ; also sheet 6
SRAM_A1: U8.J3(IO_L17N_T2_34) ; also sheet 6
SRAM_A2: U8.G4(IO_L12P_T1_MRCC_34) ; also sheet 6
SRAM_A3: U8.F2(IO_L8N_T1_34) ; also sheet 6
SRAM_A4: U8.H4(IO_L13P_T2_MRCC_34) ; also sheet 6
SRAM_A5: U8.F3(IO_L8P_T1_34) ; also sheet 6
SRAM_A6: U8.H1(IO_L14N_T2_SRCC_34) ; also sheet 6
SRAM_A7: U8.G1(IO_L9P_T1_DQS_34) ; also sheet 6
SRAM_A8: U8.L3(IO_L22P_T3_34) ; also sheet 6
SRAM_A9: U8.L2(IO_L22N_T3_34) ; also sheet 6
SRAM_A10: U8.P3(IO_L21N_T3_DQS_34) ; also sheet 6
SRAM_A11: U8.M5(IO_L23P_T3_34) ; also sheet 6
SRAM_A12: U8.L1(IO_L18N_T2_34) ; also sheet 6
SRAM_A13: U8.P4(IO_L21P_T3_DQS_34) ; also sheet 6
SRAM_A14: U8.K4(IO_L16P_T2_34) ; also sheet 6
SRAM_A15: U8.P5(IO_L24P_T3_34) ; also sheet 6
SRAM_A16: U8.P2(IO_L20P_T3_34) ; also sheet 6
SRAM_A17: U8.F4(IO_L12N_T1_MRCC_34) ; also sheet 6
SRAM_A18: U8.M1(IO_L18P_T2_34) ; also sheet 6
SRAM_BHE: U8.A5(IO_L4N_T0_34) ; also sheet 6
SRAM_BLE: U8.C4(IO_L6N_T0_VREF_34) ; also sheet 6
SRAM_CE: U8.H3(IO_L13N_T2_MRCC_34) ; also sheet 6
SRAM_D0: U8.J2(IO_L15P_T2_DQS_34) ; also sheet 6
SRAM_D1: U8.H2(IO_L14P_T2_SRCC_34) ; also sheet 6
SRAM_D2: U8.J1(IO_L15N_T2_DQS_34) ; also sheet 6
SRAM_D3: U8.E2(IO_L10P_T1_34) ; also sheet 6
SRAM_D4: U8.J4(IO_L17P_T2_34) ; also sheet 6
SRAM_D5: U8.N4(IO_L24N_T3_34) ; also sheet 6
SRAM_D6: U8.M4(IO_L23N_T3_34) ; also sheet 6
SRAM_D7: U8.N1(IO_L20N_T3_34) ; also sheet 6
SRAM_D8: U8.B5(IO_L4P_T0_34) ; also sheet 6
SRAM_D9: U8.B6(IO_0_34) ; also sheet 6
SRAM_D10: U8.C5(IO_L6P_T0_34) ; also sheet 6
SRAM_D11: U8.E4(IO_L7P_T1_34) ; also sheet 6
SRAM_D12: U8.K3(IO_L16N_T2_34) ; also sheet 6
SRAM_D13: U8.L5(IO_25_34) ; also sheet 6
SRAM_D14: U8.M2(IO_L19N_T3_VREF_34) ; also sheet 6
SRAM_D15: U8.M3(IO_L19P_T3_34) ; also sheet 6
SRAM_OE: U8.A4(IO_L2P_T0_34) ; also sheet 6
SRAM_WE: U8.D2(IO_L10N_T1_34) ; also sheet 6
VCC_30_14: R49.2 R50.1 R51.2 U8.G13(VCCO_14) U8.K13(VCCO_14) U8.N6(VCCO_0) U8.N8(VCCO_0) U8.N13(VCCO_14) ; also sheet 2,3,6
VCC_30_34: U8.G2(VCCO_34) U8.K2(VCCO_34) U8.N2(VCCO_34) ; also sheet 1,3,6
XADC_VREF: U8.H8(VREFP_0) ; also sheet 2
Unconnected: U8.A2(IO_L3N_T0_DQS_34) U8.A3(IO_L2N_T0_34) U8.B1(IO_L5N_T0_34) U8.B2(IO_L5P_T0_34) U8.B3(IO_L3P_T0_DQS_34) U8.C1(IO_L11N_T1_SRCC_34) U8.C3(IO_L1N_T0_34) U8.C14(IO_L11N_T1_SRCC_14) U8.D1(IO_L11P_T1_SRCC_34) U8.D3(IO_L1P_T0_34) U8.D4(IO_L7N_T1_34) U8.D13(IO_L8N_T1_D12_14) U8.D14(IO_L11P_T1_SRCC_14) U8.E11(IO_0_14) U8.E12(IO_L7N_T1_D10_14) U8.E13(IO_L10N_T1_D15_14) U8.F11(IO_L12N_T1_MRCC_14) U8.F12(IO_L7P_T1_D09_14) U8.F13(IO_L10P_T1_D14_14) U8.F14(IO_L9N_T1_DQS_D13_14) U8.G14(IO_L9P_T1_DQS_14) U8.H13(IO_L14P_T2_SRCC_14) U8.H14(IO_L14N_T2_SRCC_14) U8.J13(IO_L18P_T2_D28_14) U8.J14(IO_L18N_T2_D27_14) U8.K11(IO_L19P_T3_D26_14) U8.L13(IO_L16N_T2_D31_14) U8.L14(IO_L15N_T2_DQS_DOUT_CSO_B_14) U8.M10(IO_25_14) U8.M11(IO_L20P_T3_D24_14) U8.M14(IO_L21N_T3_DQS_D22_14) U8.N10(IO_L23P_T3_D19_14) U8.N14(IO_L21P_T3_DQS_14)

### Notes on the sheet
- (up side) VCC_30_34 -> SRAM
- (bottom side) VCC_30_14 -> FLASH, ADC_reference, clocks, JTAG, VCC0

## Sheet 6 of 6: FPGA Accessory
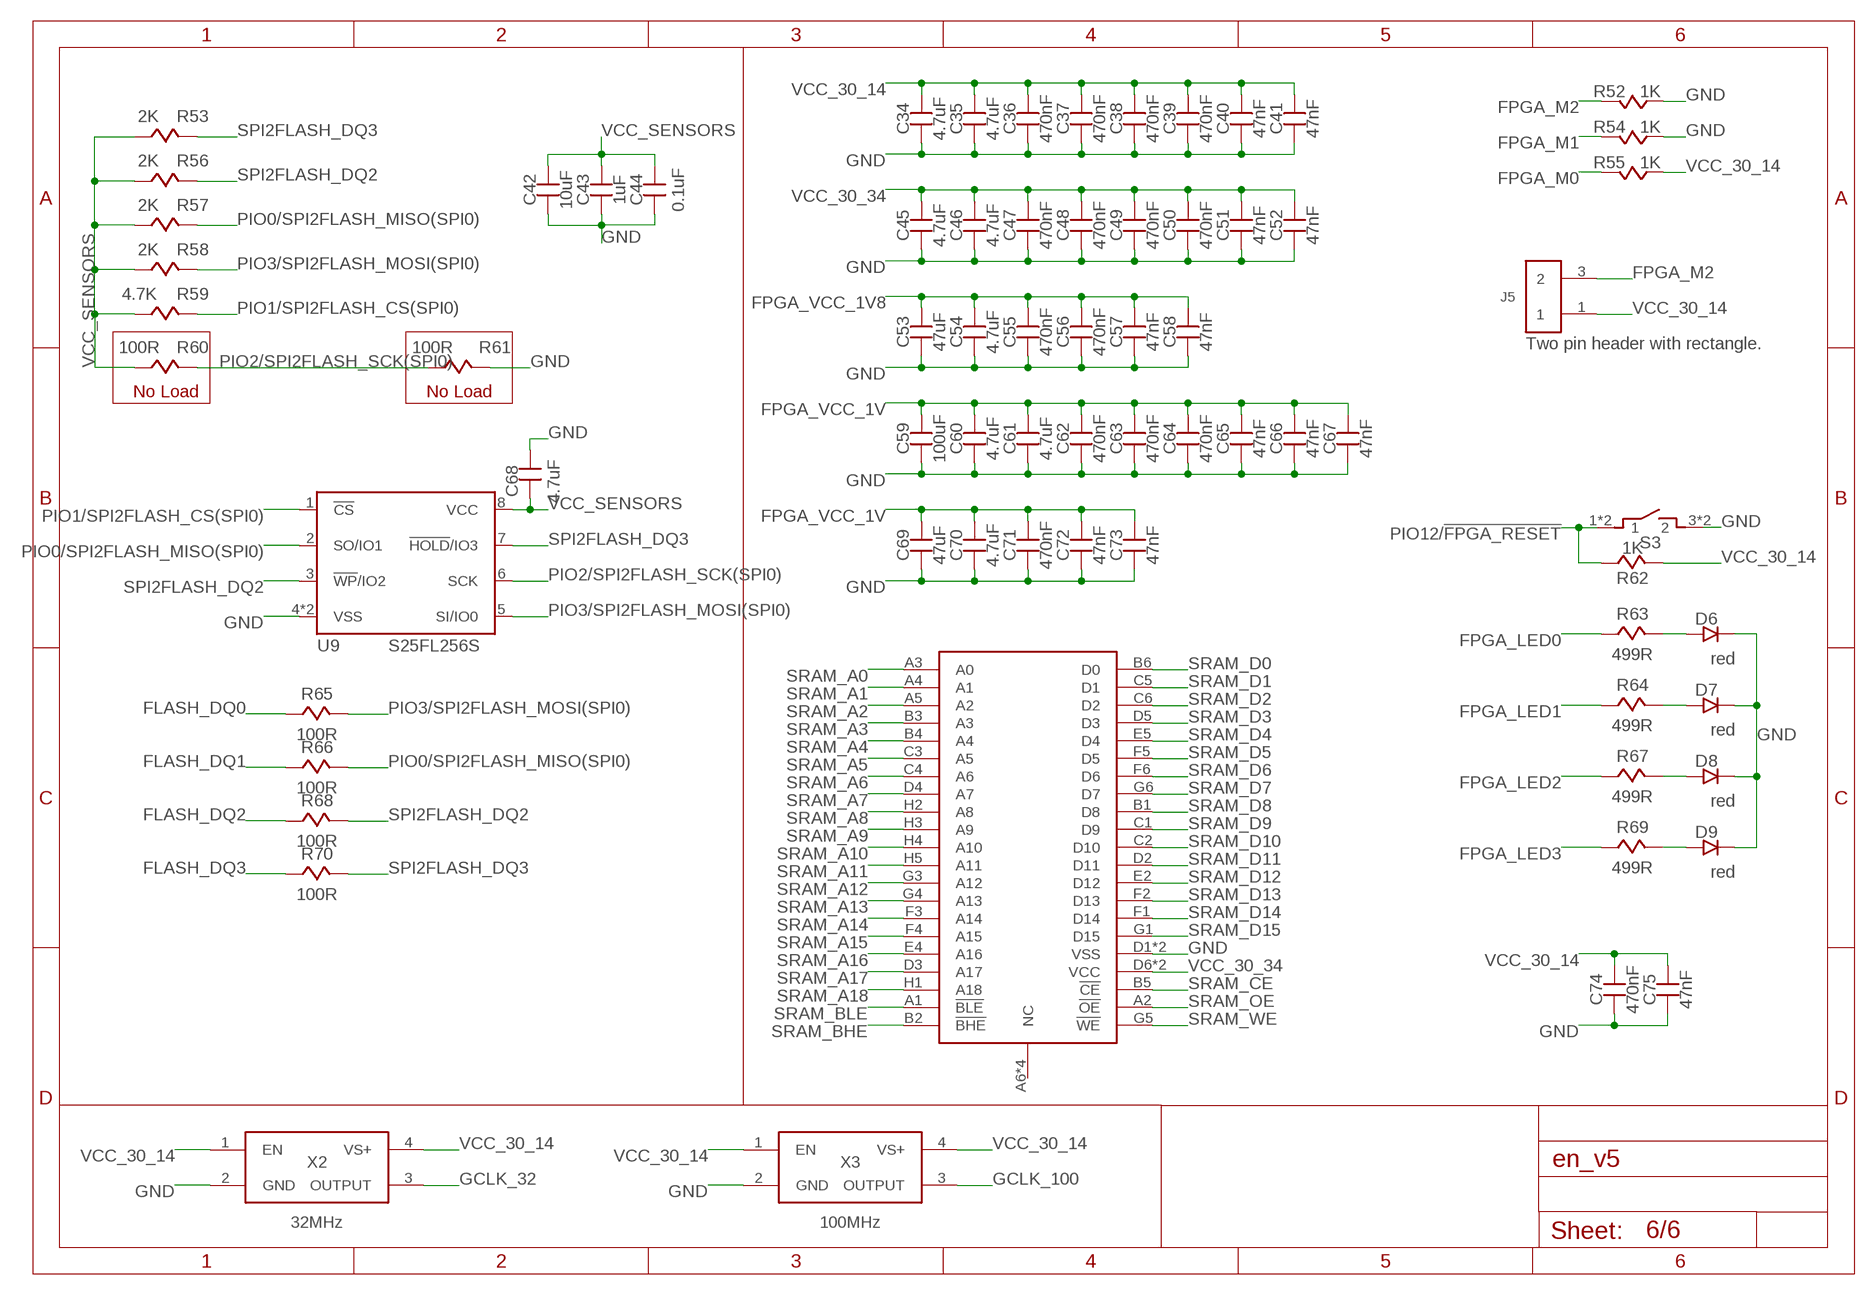
[diagram p5: schematic, sheet 6]

### Parts
C34  4.7uF  CAPACITOR0603  [CAPC1608-0603]
C35  4.7uF  CAPACITOR0603  [CAPC1608-0603]
C36  470nF  CAPACITOR0402  [0402]
C37  470nF  CAPACITOR0402  [0402]
C38  470nF  CAPACITOR0402  [0402]
C39  470nF  CAPACITOR0402  [0402]
C40  47nF  CAPACITOR0402  [0402]
C41  47nF  CAPACITOR0402  [0402]
C42  10uF  CAPACITOR0603  [CAPC1608-0603]
C43  1uF  CAPACITOR0402  [0402]
C44  0.1uF  CAPACITOR0402  [0402]
C45  4.7uF  CAPACITOR0603  [CAPC1608-0603]
C46  4.7uF  CAPACITOR0603  [CAPC1608-0603]
C47  470nF  CAPACITOR0402  [0402]
C48  470nF  CAPACITOR0402  [0402]
C49  470nF  CAPACITOR0402  [0402]
C50  470nF  CAPACITOR0402  [0402]
C51  47nF  CAPACITOR0402  [0402]
C52  47nF  CAPACITOR0402  [0402]
C53  47uF  CAPACITOR0805  [0805]
C54  4.7uF  CAPACITOR0603  [CAPC1608-0603]
C55  470nF  CAPACITOR0402  [0402]
C56  470nF  CAPACITOR0402  [0402]
C57  47nF  CAPACITOR0402  [0402]
C58  47nF  CAPACITOR0402  [0402]
C59  100uF  CAPACITOR0805  [0805]
C60  4.7uF  CAPACITOR0603  [CAPC1608-0603]
C61  4.7uF  CAPACITOR0603  [CAPC1608-0603]
C62  470nF  CAPACITOR0402  [0402]
C63  470nF  CAPACITOR0402  [0402]
C64  470nF  CAPACITOR0402  [0402]
C65  47nF  CAPACITOR0402  [0402]
C66  47nF  CAPACITOR0402  [0402]
C67  47nF  CAPACITOR0402  [0402]
C68  4.7uF  CAPACITOR0603  [CAPC1608-0603]
C69  47uF  CAPACITOR0805  [0805]
C70  4.7uF  CAPACITOR0603  [CAPC1608-0603]
C71  470nF  CAPACITOR0402  [0402]
C72  47nF  CAPACITOR0402  [0402]
C73  47nF  CAPACITOR0402  [0402]
C74  470nF  CAPACITOR0402  [0402]
C75  47nF  CAPACITOR0402  [0402]
D6  red  LED0402  [0402]
D7  red  LED0402  [0402]
D8  red  LED0402  [0402]
D9  red  LED0402  [0402]
J5  FEMALE_HEADER_2X1  [2X1_HEADER]
R52  1K  RESISTORSMD_0402  [0402]
R53  2K  RESISTORSMD_0402  [0402]
R54  1K  RESISTORSMD_0402  [0402]
R55  1K  RESISTORSMD_0402  [0402]
R56  2K  RESISTORSMD_0402  [0402]
R57  2K  RESISTORSMD_0402  [0402]
R58  2K  RESISTORSMD_0402  [0402]
R59  4.7K  RESISTORSMD_0402  [0402]
R60  100R  RESISTORSMD_0402  [0402]
R61  100R  RESISTORSMD_0402  [0402]
R62  1K  RESISTORSMD_0402  [0402]
R63  499R  RESISTORSMD_0402  [0402]
R64  499R  RESISTORSMD_0402  [0402]
R65  100R  RESISTORSMD_0402  [0402]
R66  100R  RESISTORSMD_0402  [0402]
R67  499R  RESISTORSMD_0402  [0402]
R68  100R  RESISTORSMD_0402  [0402]
R69  499R  RESISTORSMD_0402  [0402]
R70  100R  RESISTORSMD_0402  [0402]
S3  TACTILE-SWITCH  [TACTILE-SWITCH]
U9  S25FL256S  [WSON6X8MM]
U10  CY7C1051DV33  [BGA-48]
X2  32MHz  OSCILLATOR3.2X2.5  [3.2X2.5_OSC]
X3  100MHz  OSCILLATOR3.2X2.5  [3.2X2.5_OSC]

### Nets
FLASH_DQ0: R65.1 ; also sheet 5
FLASH_DQ1: R66.1 ; also sheet 5
FLASH_DQ2: R68.1 ; also sheet 5
FLASH_DQ3: R70.1 ; also sheet 5
FPGA_LED0: R63.1 ; also sheet 5
FPGA_LED1: R64.1 ; also sheet 5
FPGA_LED2: R67.1 ; also sheet 5
FPGA_LED3: R69.1 ; also sheet 5
FPGA_M0: R55.2 ; also sheet 5
FPGA_M1: R54.2 ; also sheet 5
FPGA_M2: J5.3 R52.2 ; also sheet 5
FPGA_VCC_1V: C59.2 C60.2 C61.2 C62.2 C63.2 C64.2 C65.2 C66.2 C67.2 C69.2 C70.2 C71.2 C72.2 C73.2 ; also sheet 3,5
FPGA_VCC_1V8: C53.2 C54.2 C55.2 C56.2 C57.2 C58.2 ; also sheet 3,5
GCLK_32: X2.3(OUTPUT) ; also sheet 5
GCLK_100: X3.3(OUTPUT) ; also sheet 5
GND: C34.1 C35.1 C36.1 C37.1 C38.1 C39.1 C40.1 C41.1 C42.1 C43.1 C44.1 C45.1 C46.1 C47.1 C48.1 C49.1 C50.1 C51.1 C52.1 C53.1 C54.1 C55.1 C56.1 C57.1 C58.1 C59.1 C60.1 C61.1 C62.1 C63.1 C64.1 C65.1 C66.1 C67.1 C68.2 C69.1 C70.1 C71.1 C72.1 C73.1 C74.1 C75.1 D6.2 D7.2 D8.2 D9.2 R52.1 R54.1 R61.2 S3.3 S3.4 U9.4(VSS) U9.9(VSS) U10.D1(VSS) U10.E6(VSS) X2.2(GND) X3.2(GND) ; also sheet 1,2,3,4,5
N$31: D6.1 R63.2
N$42: D7.1 R64.2
N$61: D8.1 R67.2
N$62: D9.1 R69.2
PIO0/SPI2FLASH_MISO(SPI0): R57.2 R66.2 U9.2(SO/IO1) ; also sheet 1,4
PIO1/SPI2FLASH_CS(SPI0): R59.2 U9.1(!CS) ; also sheet 1,4,5
PIO2/SPI2FLASH_SCK(SPI0): R60.2 R61.1 U9.6(SCK) ; also sheet 1,4,5
PIO3/SPI2FLASH_MOSI(SPI0): R58.2 R65.2 U9.5(SI/IO0) ; also sheet 1,4
PIO12/!FPGA_RESET: R62.1 S3.1 S3.2 ; also sheet 4,5
SPI2FLASH_DQ2: R56.2 R68.2 U9.3(!WP!/IO2)
SPI2FLASH_DQ3: R53.2 R70.2 U9.7(!HOLD!/IO3)
SRAM_A0: U10.A3(A0) ; also sheet 5
SRAM_A1: U10.A4(A1) ; also sheet 5
SRAM_A2: U10.A5(A2) ; also sheet 5
SRAM_A3: U10.B3(A3) ; also sheet 5
SRAM_A4: U10.B4(A4) ; also sheet 5
SRAM_A5: U10.C3(A5) ; also sheet 5
SRAM_A6: U10.C4(A6) ; also sheet 5
SRAM_A7: U10.D4(A7) ; also sheet 5
SRAM_A8: U10.H2(A8) ; also sheet 5
SRAM_A9: U10.H3(A9) ; also sheet 5
SRAM_A10: U10.H4(A10) ; also sheet 5
SRAM_A11: U10.H5(A11) ; also sheet 5
SRAM_A12: U10.G3(A12) ; also sheet 5
SRAM_A13: U10.G4(A13) ; also sheet 5
SRAM_A14: U10.F3(A14) ; also sheet 5
SRAM_A15: U10.F4(A15) ; also sheet 5
SRAM_A16: U10.E4(A16) ; also sheet 5
SRAM_A17: U10.D3(A17) ; also sheet 5
SRAM_A18: U10.H1(A18) ; also sheet 5
SRAM_BHE: U10.B2(!BHE) ; also sheet 5
SRAM_BLE: U10.A1(!BLE) ; also sheet 5
SRAM_CE: U10.B5(!CE) ; also sheet 5
SRAM_D0: U10.B6(D0) ; also sheet 5
SRAM_D1: U10.C5(D1) ; also sheet 5
SRAM_D2: U10.C6(D2) ; also sheet 5
SRAM_D3: U10.D5(D3) ; also sheet 5
SRAM_D4: U10.E5(D4) ; also sheet 5
SRAM_D5: U10.F5(D5) ; also sheet 5
SRAM_D6: U10.F6(D6) ; also sheet 5
SRAM_D7: U10.G6(D7) ; also sheet 5
SRAM_D8: U10.B1(D8) ; also sheet 5
SRAM_D9: U10.C1(D9) ; also sheet 5
SRAM_D10: U10.C2(D10) ; also sheet 5
SRAM_D11: U10.D2(D11) ; also sheet 5
SRAM_D12: U10.E2(D12) ; also sheet 5
SRAM_D13: U10.F2(D13) ; also sheet 5
SRAM_D14: U10.F1(D14) ; also sheet 5
SRAM_D15: U10.G1(D15) ; also sheet 5
SRAM_OE: U10.A2(!OE) ; also sheet 5
SRAM_WE: U10.G5(!WE) ; also sheet 5
VCC_30_14: C34.2 C35.2 C36.2 C37.2 C38.2 C39.2 C40.2 C41.2 C74.2 C75.2 J5.1 R55.1 R62.2 X2.1(EN) X2.4(VS+) X3.1(EN) X3.4(VS+) ; also sheet 2,3,5
VCC_30_34: C45.2 C46.2 C47.2 C48.2 C49.2 C50.2 C51.2 C52.2 U10.D6(VCC) U10.E1(VCC) ; also sheet 1,3,5
VCC_SENSORS: C42.2 C43.2 C44.2 C68.1 R53.1 R56.1 R57.1 R58.1 R59.1 R60.1 U9.8(VCC) ; also sheet 1,3
Unconnected: U10.A6(NC) U10.E3(NC) U10.G2(NC) U10.H6(NC)

### Notes on the sheet
- Two pin header with rectangle.
- No Load | No Load

## Library data of the parts
C1-C75 = passive:CAPACITOR; OC_NEWARK: unknown
D1 = diodes:SCHOTTKY_DIODE; OC_NEWARK: unknown
D2-D9 = opto:LED; OC_NEWARK: unknown
J1 J2 = connectors:M50-3142045: Headers & Wire Housings 20 WAY SIL VERT SMT SKT Source: Datasheet <https://componentsearchengine.com/Datasheets/1/M50-3142045.pdf>; OC_NEWARK: unknown
J3 = 53261-0271:53261-0271: Conn Shrouded Header HDR 2 POS 1.25mm Solder RA SMD PicoBlade™ Embossed T/R Check availability <https://pricing.snapeda.com/parts/53261-0271/Molex/view-part?ref=eda>; AVAILABILITY: In Stock; DESCRIPTION: Connector Header Surface Mount, Right Angle 2 position 0.049 (1.25mm); MF: Molex; MP: 53261-0271; PACKAGE: None; PRICE: None; PURCHASE-URL: https://pricing.snapeda.com/search/part/53261-0271/?ref=eda
J4 = connectors:USB4105-GF-A: USB-C (USB TYPE-C) USB 2.0 Receptacle Connector 24 (16+8 Dummy) Position Surface Mount, Right Angle; Through Hole Check availability <https://pricing.snapeda.com/parts/USB4105-GF-A/GCT/view-part?ref=eda>; AVAILABILITY: In Stock; DESCRIPTION: USB-C (USB TYPE-C) USB 2.0 Receptacle Connector 24 (16+8 Dummy) Position Surface Mount, Right Angle; Through Hole; MF: GCT; MP: USB4105-GF-A; PACKAGE: None; PRICE: None; PURCHASE-URL: https://pricing.snapeda.com/search/part/USB4105-GF-A/?ref=eda
J5 = connectors:FEMALE_HEADER_2X1; OC_NEWARK: unknown
L1-L3 = passive:INDUCTOR; OC_NEWARK: unknown
M1 M2 = power:SISS23DN; OC_NEWARK: unknown
Q1 = transistor:FDN302P: P-Channel MOSFET 2.5V Specified PowerTrench Check prices <https://pricing.snapeda.com/parts/FDN302P/ON%20Semiconductor/view-part?ref=eda>; OC_NEWARK: unknown
R1-R70 = passive:RESISTOR; OC_NEWARK: unknown
S1-S3 = connectors:TACTILE-SWITCH: 612-TL3365AF180QG; OC_NEWARK: unknown
TP1 TP2 = connectors:TEST_POINT
U1 = power:REF3012AIDBZR: CMOS VOLTAGE REFERENCE Check prices <https://pricing.snapeda.com/parts/REF3012AIDBZR/Texas%20Instruments/view-part?ref=eda>; AVAILABILITY: Good; DESCRIPTION: 1.25-V, 50-ppm/C, 50-A in 3-pin SOT-23 package series (bandgap) voltage reference 3-SOT-23 -40 to 125; MP: REF3012AIDBZR; OC_NEWARK: unknown; PACKAGE: SOT-23-3 Texas Instruments; PRICE: None; PURCHASE-URL: https://pricing.snapeda.com/search/part/REF3012AIDBZR/?ref=eda
U2 = power:MCP73833T-AMI/MF: Linear Charge Management Controller Li-Ion/Li-Pol 1mA 4.2V/4.35V/4.4V/4.5V 10-Pin DFN EP T/R Check prices <https://pricing.snapeda.com/parts/MCP73833T-AMI/MF/Microchip%20Technology/view-part?ref=eda>; OC_NEWARK: unknown
U3 = power:LTC3569EUDPBF: Triple Buck Regulator with 1.2A and Two 600mA Outputs and Individual Programmable References Check availability <https://pricing.snapeda.com/parts/LTC3569EUD%23PBF/Analog%20Devices/view-part?ref=eda>; AVAILABILITY: In Stock; DESCRIPTION: Buck Switching Regulator IC Positive Adjustable 0.425V 3 Output 600mA, 1.2A 20-WFQFN Exposed Pad; MF: Analog Devices; MP: LTC3569EUD#PBF; PACKAGE: QFN -20 Analog Devices; PRICE: None; PURCHASE-URL: https://pricing.snapeda.com/search/part/LTC3569EUD#PBF/?ref=eda
U4 U5 = sensors:PAC1934: Current & Power Monitors & Regulators Quad High-Side Current Sensor, I2C/SMBus, 32V with Accumulator; OC_NEWARK: unknown
U6 = ic:W25Q16JVUXIQ: W25Q16JV - NOR Flash Technical Specifications: VCC: 2.7-3.6V Operating Temperature: -40°C to 85°C Mouser: 454-W25Q16JVUXIQTR
U7 = device:RP2040; OC_NEWARK: unknown
U8 = fpga:SPARTAN7-LX15
U9 = ic:S25FL256S: FLASH - NOR Memory IC 256Mb (32M x 8) SPI - Quad I/O WSON-8 (6x8) Source: Datasheet <https://www.cypress.com/file/448601/download> Check prices <https://www.mouser.de/ProductDetail/Cypress-Spansion/S25FL256SAGNFI001?qs=rDGpJoRV1kKsEn98ei3h6w%3D%3D>
U10 = ic:CY7C1051DV33: SRAM 8Mb 10ns3.3V 512Kx16 Fast Async; OC_NEWARK: unknown
X1 = passive:QUARTZ
X2 X3 = passive:OSCILLATOR; OC_NEWARK: unknown

## Net classes
1 diff pairs: width 0.102 mm